# Altium project bcd_8_bit.PrjPcb
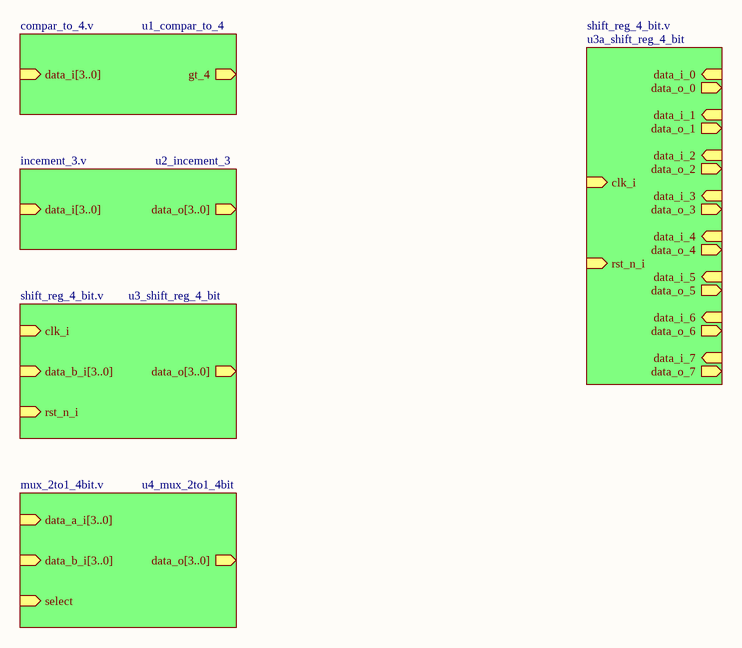
[diagram p0: BDC_BS1.SchDoc]
2 sheets, 5 parts. Net scope: hierarchical (ports join the sheet entries above them; power ports are global).
Sheets:
  BDC_BS1.SchDoc
  PipeLine.SchDoc

## Sheet BDC_BS1.SchDoc
size A4

### Sub-sheets
u1_compar_to_4 = compar_to_4.v (file not in this document): data_i[3..0] (in), gt_4 (out)
u2_incement_3 = incement_3.v (file not in this document): data_i[3..0] (in), data_o[3..0] (out)
u3_shift_reg_4_bit = shift_reg_4_bit.v (file not in this document): clk_i (in), data_b_i[3..0] (in), data_o[3..0] (out), rst_n_i (in)
u3a_shift_reg_4_bit = shift_reg_4_bit.v (file not in this document): data_i_0 (in), clk_i (in), rst_n_i (in), data_o_0 (out), data_i_1 (in), data_i_2 (in), data_i_3 (in), data_i_4 (in), data_i_5 (in), data_i_6 (in), data_i_7 (in), data_o_1 (out), data_o_2 (out), data_o_3 (out), data_o_4 (out), data_o_5 (out), data_o_6 (out), data_o_7 (out)
u4_mux_2to1_4bit = mux_2to1_4bit.v (file not in this document): data_a_i[3..0] (in), data_b_i[3..0] (in), data_o[3..0] (out), select (in)

## Sheet PipeLine.SchDoc
size A3
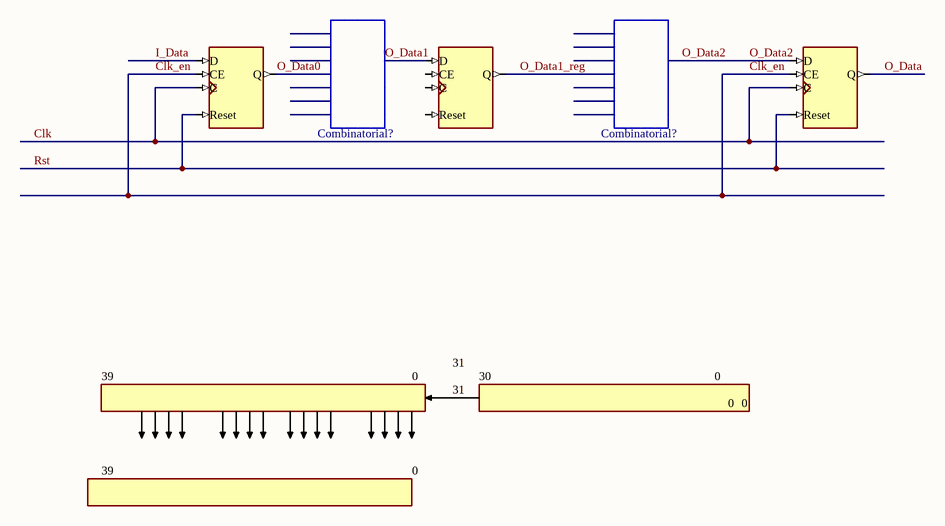
[diagram p1: PipeLine.SchDoc]

### Parts
(Parts that share a designator on the sheet are numbered #1, #2 ... from top to bottom, then left to right.)
*#1  Reg_8  (value not drawn)
*#2  Reg_8  (value not drawn)
*#3  Reg_8  (value not drawn)
Combinatorial?#1  Device Mode  (value not drawn)
Combinatorial?#2  Device Mode  (value not drawn)

### Nets
Clk: *#1.3(C) *#3.3(C)
Clk_en: *#1.2(D) *#3.2(D)
I_Data: *#1.1(D)
O_Data: *#3.6(Q)
O_Data0: *#1.6(Q) Combinatorial?#1.16
O_Data1: *#2.1(D) Combinatorial?#1.5
O_Data1_reg: *#2.6(Q) Combinatorial?#2.16
O_Data2: *#3.1(D) Combinatorial?#2.5
Rst: *#1.4(C) *#3.4(C)

Not connected (* = marked no-connect by the designer): *#2 2(D) 3(C) 4(C); Combinatorial?#1 0 1 2 3 4 6 7 8 9 10 11 12 13 14 15 17 18 19; Combinatorial?#2 0 1 2 3 4 6 7 8 9 10 11 12 13 14 15 17 18 19

### Notes on the sheet
- 31
- 39
- 0
- 30
- (in symbol Reg_8) CE; Reset

### Library data of the parts
Combinatorial?#1 Combinatorial?#2 = 40x80_1